# EAGLE design pwm_driver (EAGLE 9.3.1)
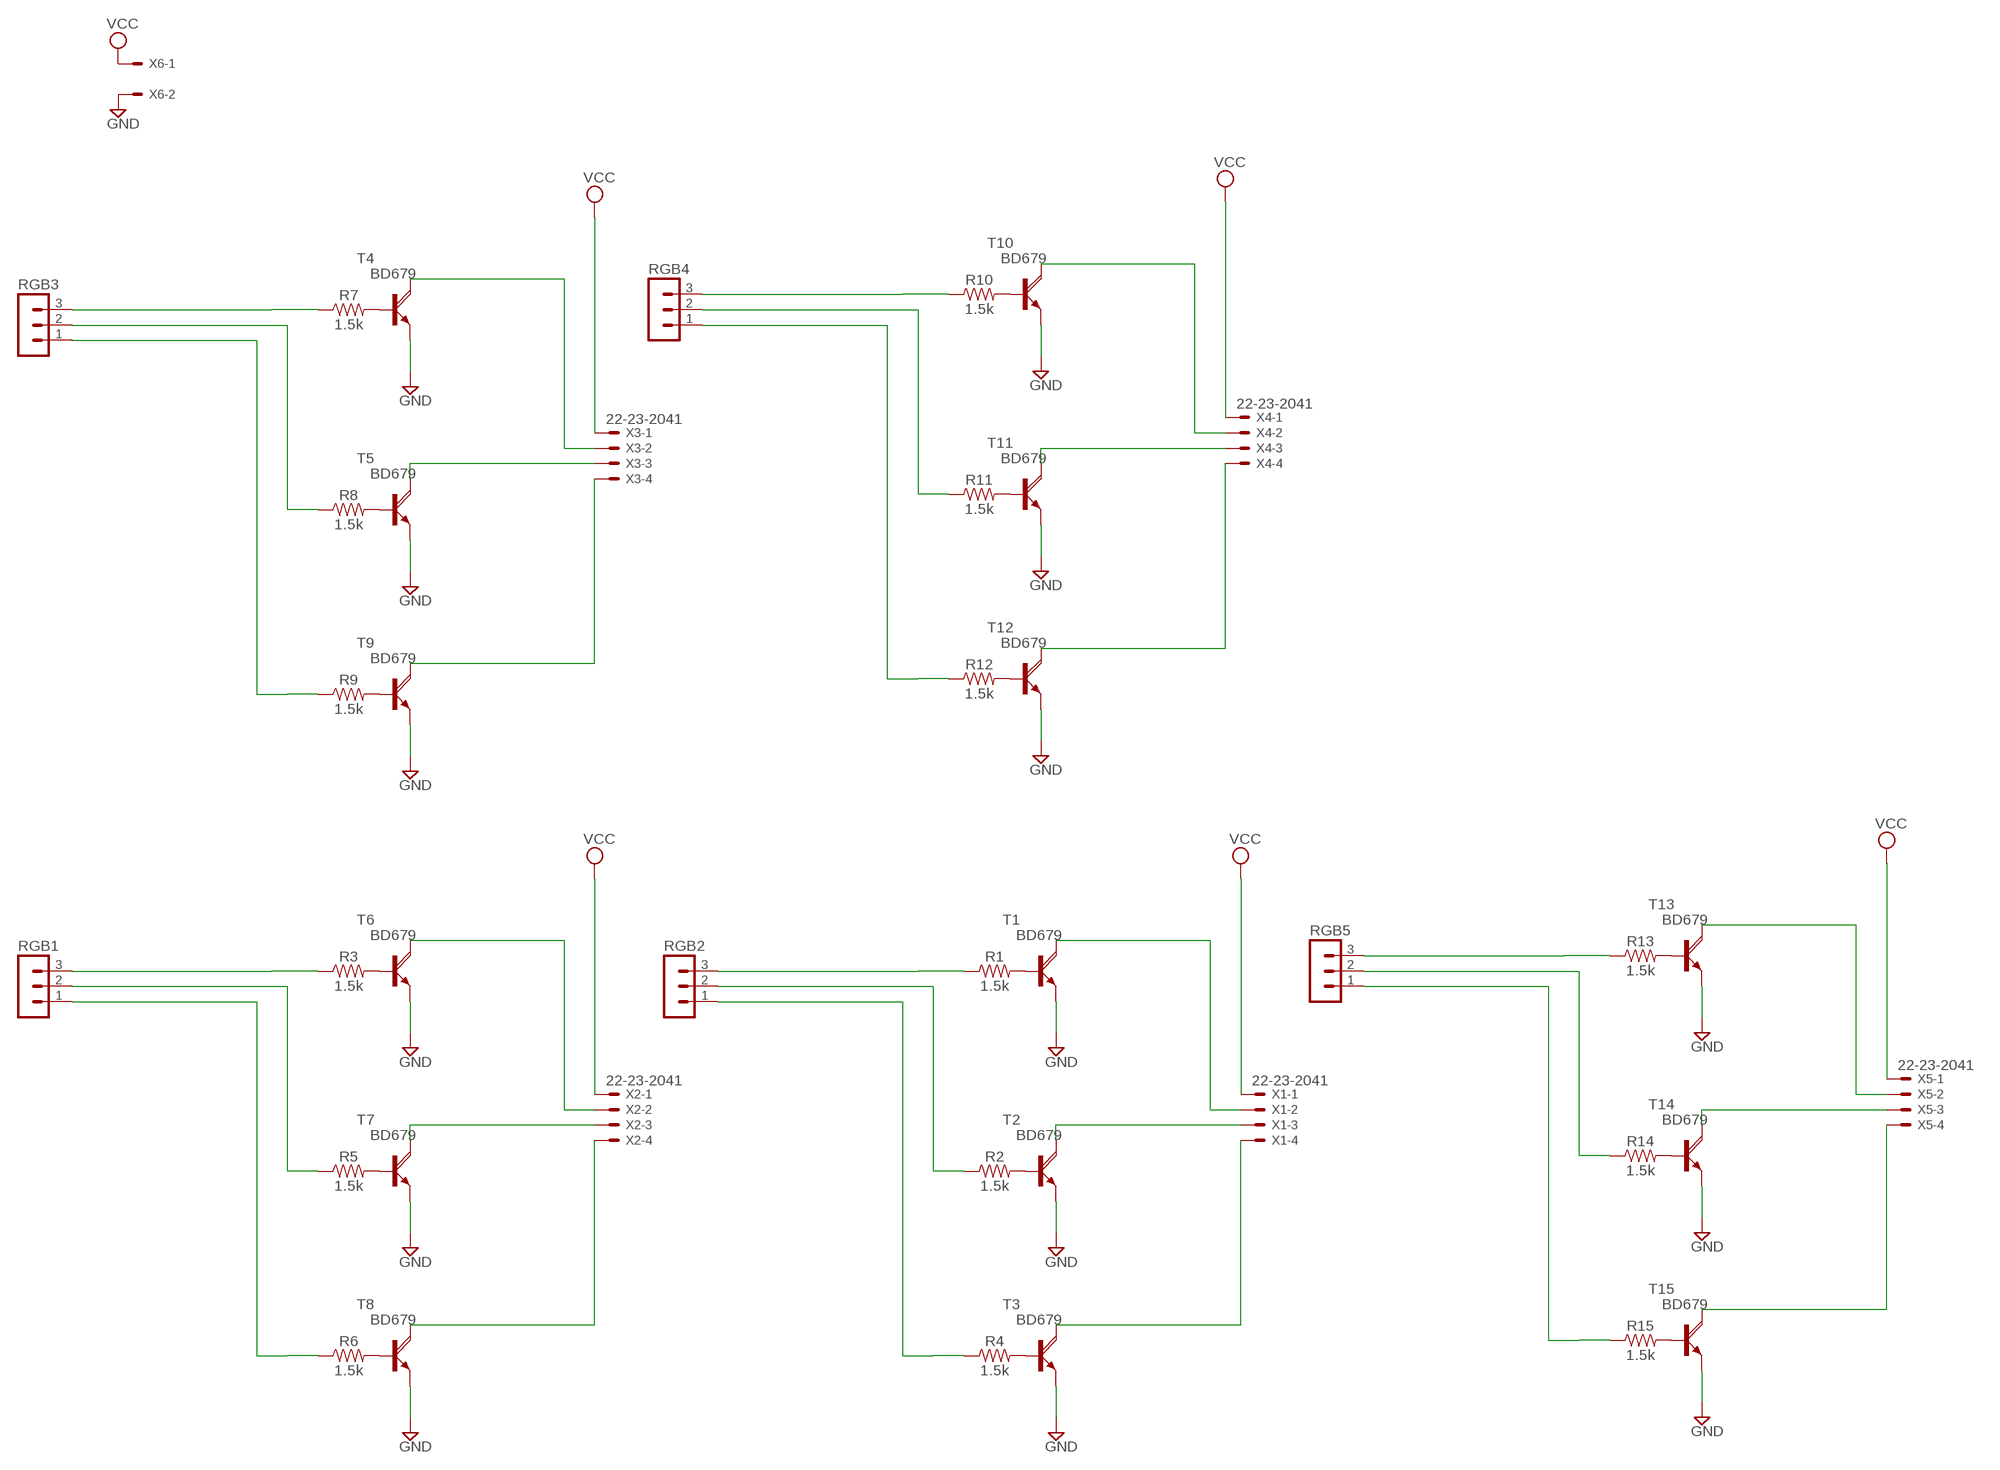
[diagram p0: schematic, sheet 1]

## Parts
R1  1.5k  1.5KOHM-0603-1/10W-1%  [0603]
R2  1.5k  1.5KOHM-0603-1/10W-1%  [0603]
R3  1.5k  1.5KOHM-0603-1/10W-1%  [0603]
R4  1.5k  1.5KOHM-0603-1/10W-1%  [0603]
R5  1.5k  1.5KOHM-0603-1/10W-1%  [0603]
R6  1.5k  1.5KOHM-0603-1/10W-1%  [0603]
R7  1.5k  1.5KOHM-0603-1/10W-1%  [0603]
R8  1.5k  1.5KOHM-0603-1/10W-1%  [0603]
R9  1.5k  1.5KOHM-0603-1/10W-1%  [0603]
R10  1.5k  1.5KOHM-0603-1/10W-1%  [0603]
R11  1.5k  1.5KOHM-0603-1/10W-1%  [0603]
R12  1.5k  1.5KOHM-0603-1/10W-1%  [0603]
R13  1.5k  1.5KOHM-0603-1/10W-1%  [0603]
R14  1.5k  1.5KOHM-0603-1/10W-1%  [0603]
R15  1.5k  1.5KOHM-0603-1/10W-1%  [0603]
RGB1  MA03-1  [MA03-1]
RGB2  MA03-1  [MA03-1]
RGB3  MA03-1  [MA03-1]
RGB4  MA03-1  [MA03-1]
RGB5  MA03-1  [MA03-1]
T1  BD679  [TO126AV]
T2  BD679  [TO126AV]
T3  BD679  [TO126AV]
T4  BD679  [TO126AV]
T5  BD679  [TO126AV]
T6  BD679  [TO126AV]
T7  BD679  [TO126AV]
T8  BD679  [TO126AV]
T9  BD679  [TO126AV]
T10  BD679  [TO126AV]
T11  BD679  [TO126AV]
T12  BD679  [TO126AV]
T13  BD679  [TO126AV]
T14  BD679  [TO126AV]
T15  BD679  [TO126AV]
X1  22-23-2041  [22-23-2041]
X2  22-23-2041  [22-23-2041]
X3  22-23-2041  [22-23-2041]
X4  22-23-2041  [22-23-2041]
X5  22-23-2041  [22-23-2041]
X6  KK-156-2  [KK-156-2]

## Nets
GND: T1.E T2.E T3.E T4.E T5.E T6.E T7.E T8.E T9.E T10.E T11.E T12.E T13.E T14.E T15.E X6.2
N$1: R3.2 T6.B
N$2: R5.2 T7.B
N$3: R6.2 T8.B
N$4: R1.1 RGB2.3
N$5: R2.1 RGB2.2
N$6: R4.1 RGB2.1
N$7: T1.C X1.2
N$8: T2.C X1.3
N$9: T3.C X1.4
N$10: R1.2 T1.B
N$11: R2.2 T2.B
N$12: R4.2 T3.B
N$13: R7.1 RGB3.3
N$14: R8.1 RGB3.2
N$15: R9.1 RGB3.1
N$16: R3.1 RGB1.3
N$17: R5.1 RGB1.2
N$18: R6.1 RGB1.1
N$19: T4.C X3.2
N$20: T5.C X3.3
N$21: T6.C X2.2
N$22: T7.C X2.3
N$23: T8.C X2.4
N$24: T9.C X3.4
N$25: R7.2 T4.B
N$26: R8.2 T5.B
N$27: R9.2 T9.B
N$28: R10.1 RGB4.3
N$29: R11.1 RGB4.2
N$30: R12.1 RGB4.1
N$31: T10.C X4.2
N$32: T11.C X4.3
N$33: T12.C X4.4
N$34: R10.2 T10.B
N$35: R11.2 T11.B
N$36: R12.2 T12.B
N$37: R13.1 RGB5.3
N$38: R14.1 RGB5.2
N$39: R15.1 RGB5.1
N$40: T13.C X5.2
N$41: T14.C X5.3
N$42: T15.C X5.4
N$43: R13.2 T13.B
N$44: R14.2 T14.B
N$45: R15.2 T15.B
VCC: X1.1 X2.1 X3.1 X4.1 X5.1 X6.1

## Library data of the parts
R1-R15 = SparkFun-Resistors:1.5KOHM: 1.5kΩ resistor A resistor is a passive two-terminal electrical component that implements electrical resistance as a circuit element. Resistors act to reduce current flow, and, at the same time, act to lower voltage levels within circuits. - Wikipedia; PROD_ID: RES-08306
RGB1-RGB5 = con-lstb:MA03-1: PIN HEADER; OC_FARNELL: unknown; OC_NEWARK: unknown
T1-T15 = transistor-power:BD679: NPN DARLINGTON TRANSISTOR
X1-X5 = con-molex:22-23-2041: .100" (2.54mm) Center Header - 4 Pin; MF: MOLEX; MPN: 22-23-2041; OC_FARNELL: 1462920; OC_NEWARK: 38C0355
X6 = con-molex:KK-156-2: KK 156 HEADER Source: http://www.molex.com/pdm_docs/sd/026604100_sd.pdf; MF: MOLEX; OC_FARNELL: unknown; OC_NEWARK: unknown

## Board
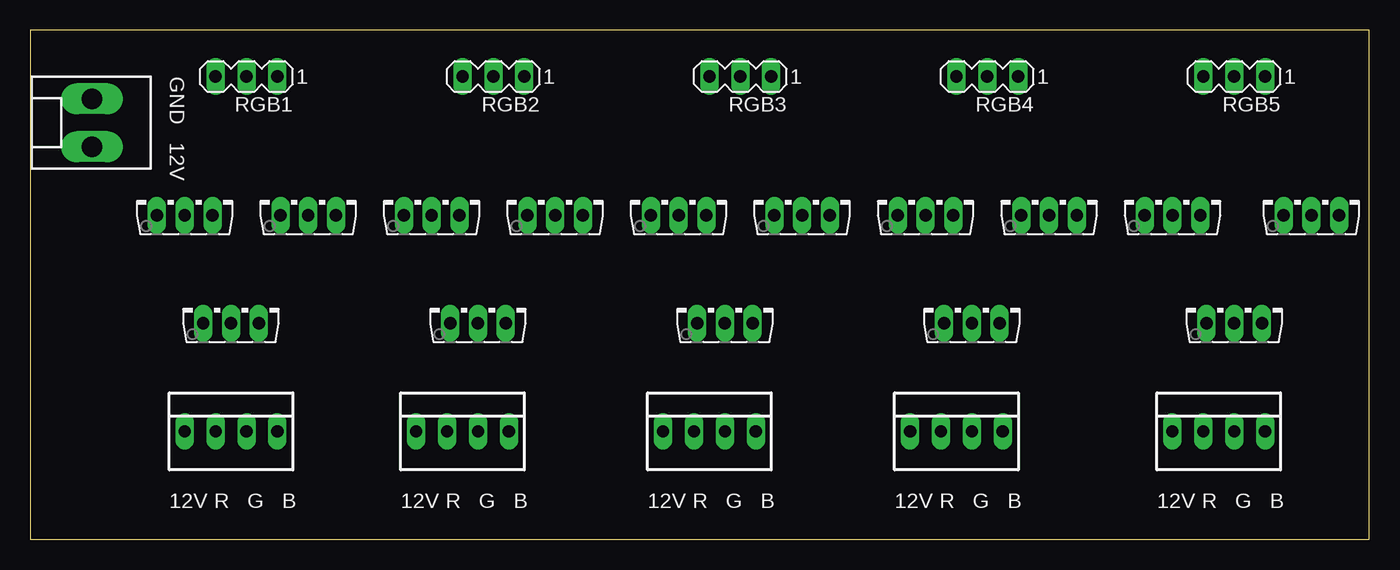
[diagram p1: board, top side]
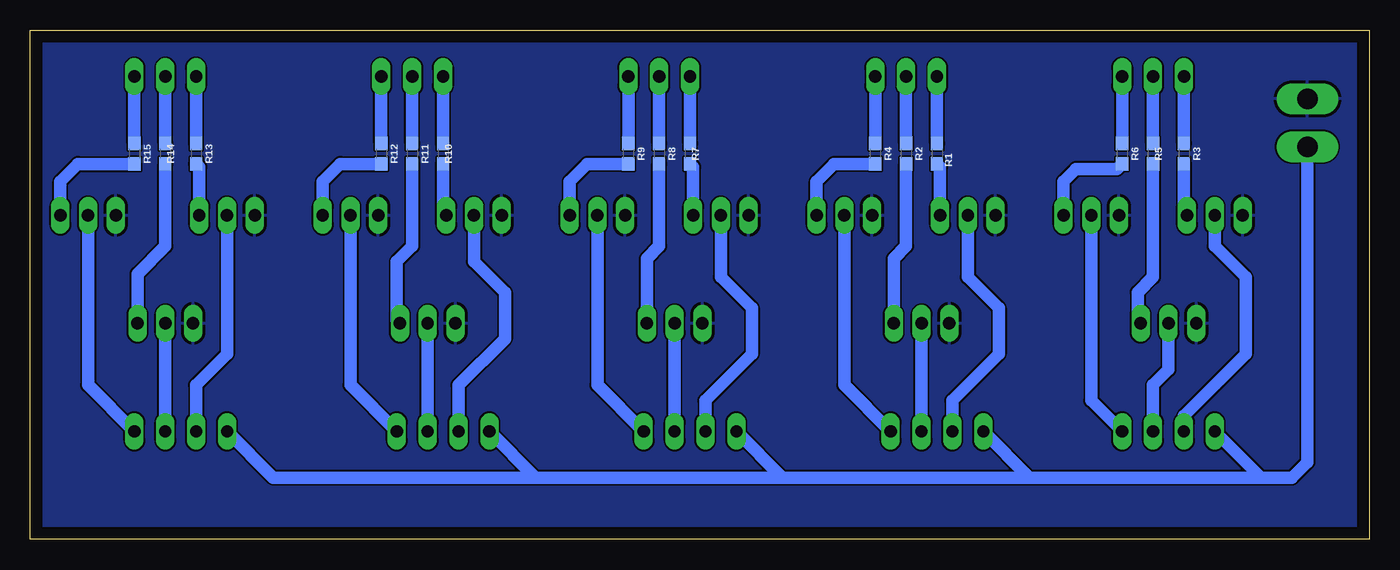
[diagram p2: board, bottom side, seen from below]

Size 110.16 x 41.9 mm. Coordinates in mm from the lower left corner, seen from the top.
Outline: 0,0 110.16,0 110.16,41.9 0,41.9 0,0
Copper layers (1*16): Top 0.035mm / dielectric 1.5mm / Bottom 0.035mm
Design rules "default": minimum track width 6mil, minimum drill 0.35mm, track to track 6mil, track to pad 6mil, pad to pad 6mil, via to via 6mil, smd to smd 6mil, copper to edge 40mil, drill to drill 6mil, minimum pad ring 10mil, minimum via ring 8mil, stop-mask expansion 4mil, vias tented up to drill 0mil, thermal gap 10mil

### Footprints (pad centres in the part's own frame; a part is rotated, then mirrored left to right if it is on the bottom)
0603 = smd 1.1 x 1: 1 -0.85,0; 2 0.85,0
MA03-1 = drill 1.016 long: 1 -2.54,0; 2 0,0; 3 2.54,0
TO126AV = drill 1.016 long: B 2.286,-1.27; C 0,-1.27; E -2.286,-1.27
22-23-2041 = drill 1 long: 1 -3.81,0; 2 -1.27,0; 3 1.27,0; 4 3.81,0
KK-156-2 = drill 1.7 pad 2.184 long: 1 -1.98,0; 2 1.98,0

### Placement (x,y rotation side)
R1  35.56,31.75 270 bottom
R2  38.1,31.75 270 bottom
R3  15.24,31.75 270 bottom
R4  40.64,31.75 270 bottom
R5  17.78,31.75 270 bottom
R6  20.32,31.75 270 bottom
R7  55.88,31.75 270 bottom
R8  58.42,31.75 270 bottom
R9  60.96,31.75 270 bottom
R10  76.2,31.75 270 bottom
R11  78.74,31.75 270 bottom
R12  81.28,31.75 270 bottom
R13  96.52,31.75 270 bottom
R14  99.06,31.75 270 bottom
R15  101.6,31.75 270 bottom
RGB1  17.78,38.1 180 top
RGB2  38.1,38.1 180 top
RGB3  58.42,38.1 180 top
RGB4  78.74,38.1 180 top
RGB5  99.06,38.1 180 top
T1  33.02,27.94 0 top
T2  36.83,19.05 0 top
T3  43.18,27.94 0 top
T4  53.34,27.94 0 top
T5  57.15,19.05 0 top
T6  12.7,27.94 0 top
T7  16.51,19.05 0 top
T8  22.86,27.94 0 top
T9  63.5,27.94 0 top
T10  73.66,27.94 0 top
T11  77.47,19.05 0 top
T12  83.82,27.94 0 top
T13  93.98,27.94 0 top
T14  99.06,19.05 0 top
T15  105.41,27.94 0 top
X1  35.56,8.89 0 top
X2  16.51,8.89 0 top
X3  55.88,8.89 0 top
X4  76.2,8.89 0 top
X5  97.79,8.89 0 top
X6  5.08,34.29 90 top

### Tracks (layer width: path | path; a pad name or v marks a point on that pad's centre or on a via)
GND
  pour Bottom: 0,41.91 110.49,41.91 110.49,0 0,0
N$1
  Bottom 1.016: R3.2 15.24,26.92 T6.B
N$2
  Bottom 1.016: R5.2 17.78,21.59 19.05,20.32 19.05,18.03 T7.B
N$3
  Bottom 1.016: R6.2 20.74,30.48 24.13,30.48 25.15,29.46 T8.B
N$4
  Bottom 1.016: R1.1 RGB2.3
N$5
  Bottom 1.016: R2.1 RGB2.2
N$6
  Bottom 1.016: R4.1 RGB2.1
N$7
  Bottom 1.016: T1.C 33.02,21.59 30.48,19.05 30.48,15.24 34.29,11.43 X1.2
N$8
  Bottom 1.016: X1.3 T2.C
N$9
  Bottom 1.016: T3.C 43.18,12.7 X1.4
N$10
  Bottom 1.016: T1.B 35.31,30.65 R1.2
N$11
  Bottom 1.016: T2.B 39.12,23.11 38.1,24.13 R2.2
N$12
  Bottom 1.016: T3.B 45.47,29.46 44.03,30.9 R4.2
N$13
  Bottom 1.016: R7.1 RGB3.3
N$14
  Bottom 1.016: R8.1 RGB3.2
N$15
  Bottom 1.016: R9.1 RGB3.1
N$16
  Bottom 1.016: R3.1 RGB1.3
N$17
  Bottom 1.016: R5.1 RGB1.2
N$18
  Bottom 1.016: R6.1 RGB1.1
N$19
  Bottom 1.016: T4.C 53.34,21.59 50.8,19.05 50.8,15.24 54.61,11.43 X3.2
N$20
  Bottom 1.016: X3.3 T5.C
N$21
  Bottom 1.016: T6.C 12.7,24.13 10.16,21.59 10.16,15.24 15.24,10.16 X2.2
N$22
  Bottom 1.016: X2.3 17.78,12.7 16.51,13.97 T7.C
N$23
  Bottom 1.016: T8.C 22.86,11.43 X2.4
N$24
  Bottom 1.016: T9.C 63.5,12.7 X3.4
N$25
  Bottom 1.016: T4.B 55.63,30.65 R7.2
N$26
  Bottom 1.016: T5.B 59.44,23.11 58.42,24.13 R8.2
N$27
  Bottom 1.016: T9.B 65.79,29.46 64.35,30.9 R9.2
N$28
  Bottom 1.016: R10.1 RGB4.3
N$29
  Bottom 1.016: R11.1 RGB4.2
N$30
  Bottom 1.016: R12.1 RGB4.1
N$31
  Bottom 1.016: T10.C 73.66,22.86 71.12,20.32 71.12,16.51 74.93,12.7 X4.2
N$32
  Bottom 1.016: X4.3 T11.C
N$33
  Bottom 1.016: T12.C 83.82,12.7 X4.4
N$34
  Bottom 1.016: T10.B 76.2,26.92 R10.2
N$35
  Bottom 1.016: T11.B 80.01,18.03 80.01,22.86 78.74,24.13 R11.2
N$36
  Bottom 1.016: T12.B 86.11,29.46 84.67,30.9 R12.2
N$37
  Bottom 1.016: R13.1 RGB5.3
N$38
  Bottom 1.016: R14.1 RGB5.2
N$39
  Bottom 1.016: R15.1 RGB5.1
N$40
  Bottom 1.016: X5.2 96.52,12.7 93.98,15.24 T13.C
N$41
  Bottom 1.016: X5.3 T14.C
N$42
  Bottom 1.016: T15.C 105.41,12.7 X5.4
N$43
  Bottom 1.016: T13.B 96.27,30.65 R13.2
N$44
  Bottom 1.016: T14.B 101.35,21.84 99.06,24.13 R14.2
N$45
  Bottom 1.016: T15.B 107.7,29.46 106.26,30.9 R15.2
VCC
  Bottom 1.016: X6.1 5.08,6.35 6.35,5.08 8.89,5.08 | 8.89,5.08 27.94,5.08 | 27.94,5.08 48.26,5.08 | 48.26,5.08 68.58,5.08 | 68.58,5.08 90.17,5.08 X5.1 | X2.1 8.89,5.08 | X1.1 27.94,5.08 | X3.1 48.26,5.08 | X4.1 68.58,5.08

### Text on the board
tNames: GND 12V | 12V R G B | 12V R G B | 12V R G B | 12V R G B | 12V R G B